# Altium schematic sheet 0181_BLANK.SchDoc
size 848 x 558 mm
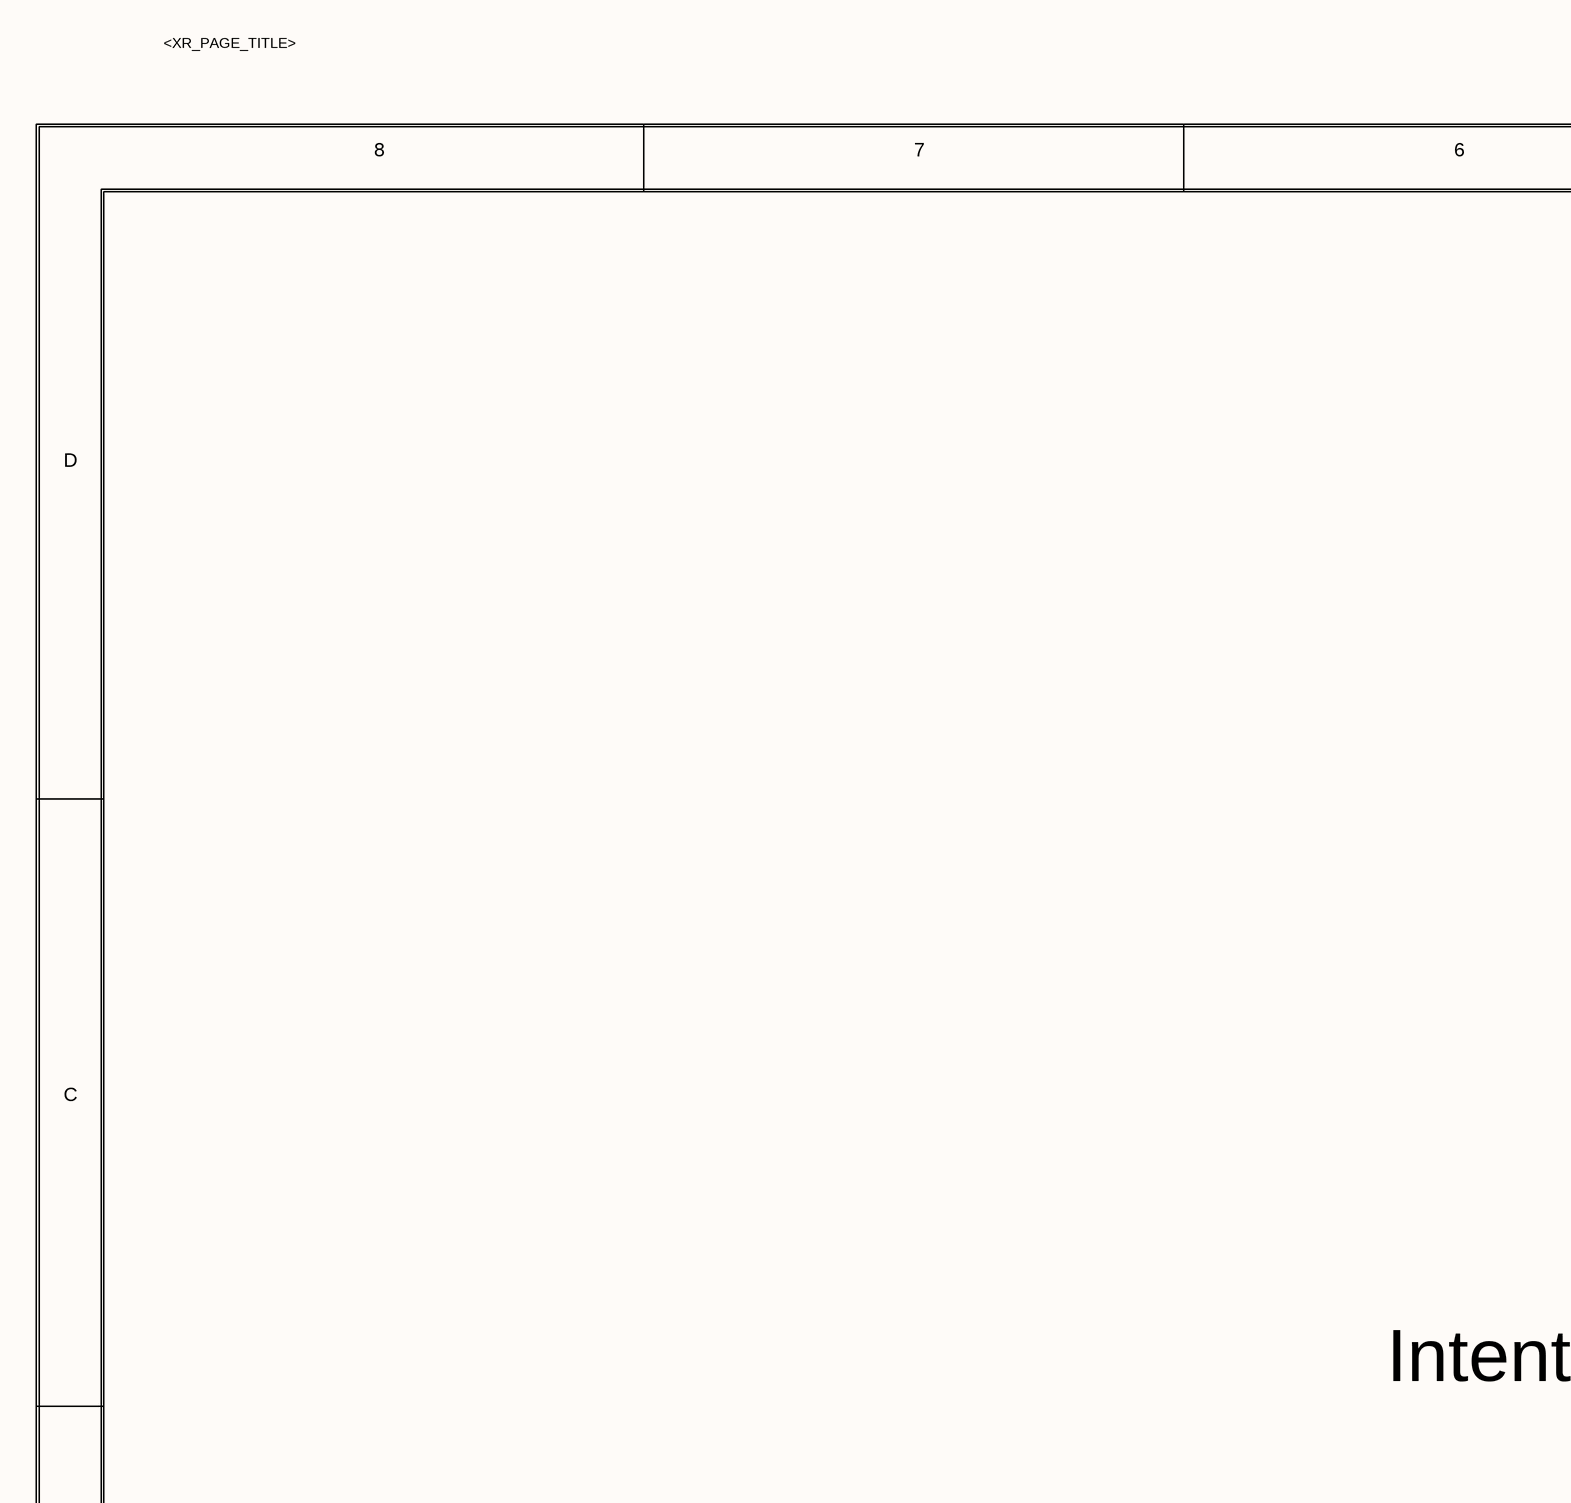
[diagram p0: 0181_BLANK.SchDoc, top left]
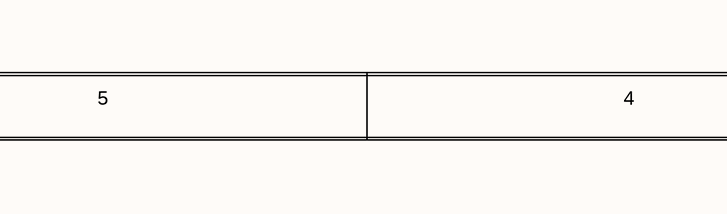
[diagram p1: 0181_BLANK.SchDoc, top middle]
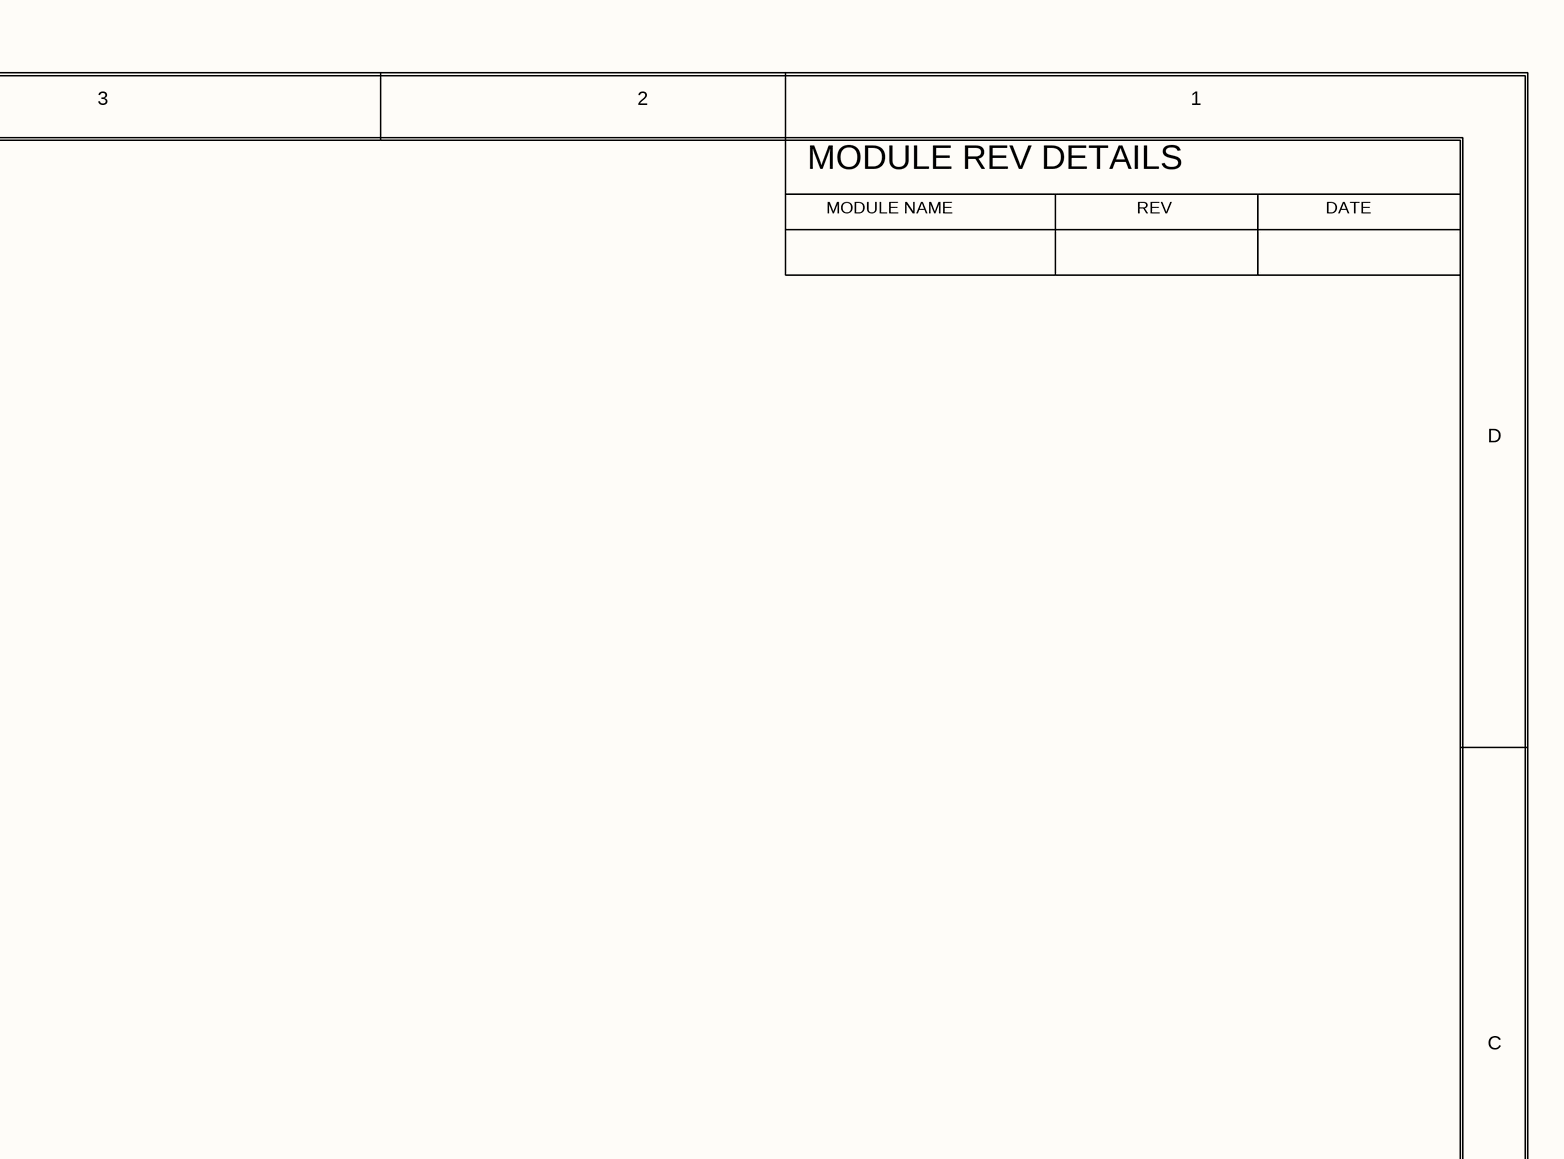
[diagram p2: 0181_BLANK.SchDoc, top right]
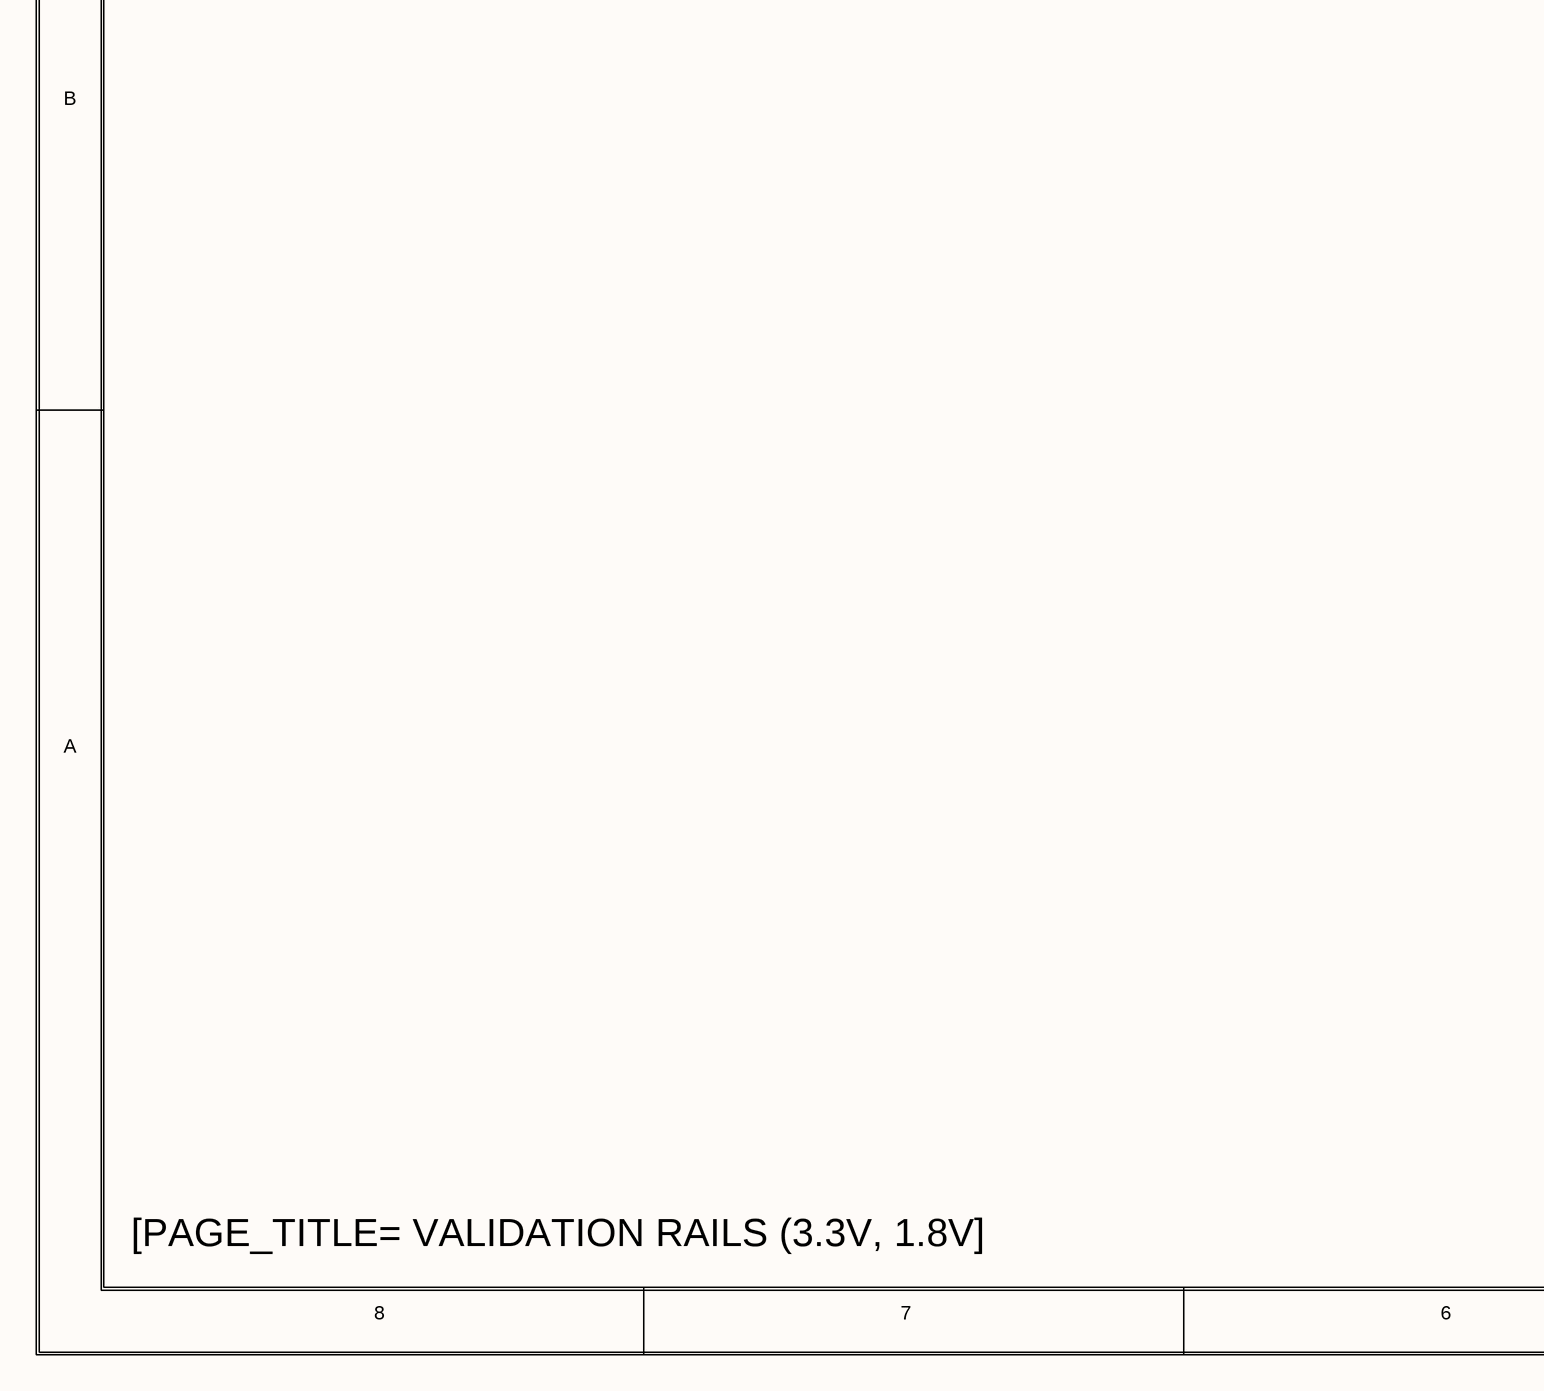
[diagram p3: 0181_BLANK.SchDoc, bottom left]
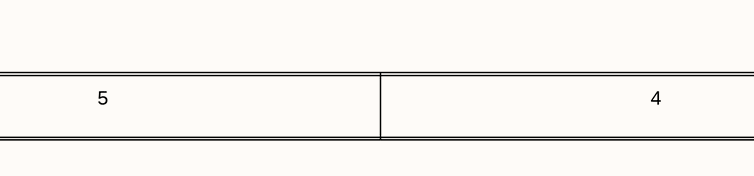
[diagram p4: 0181_BLANK.SchDoc, bottom middle]
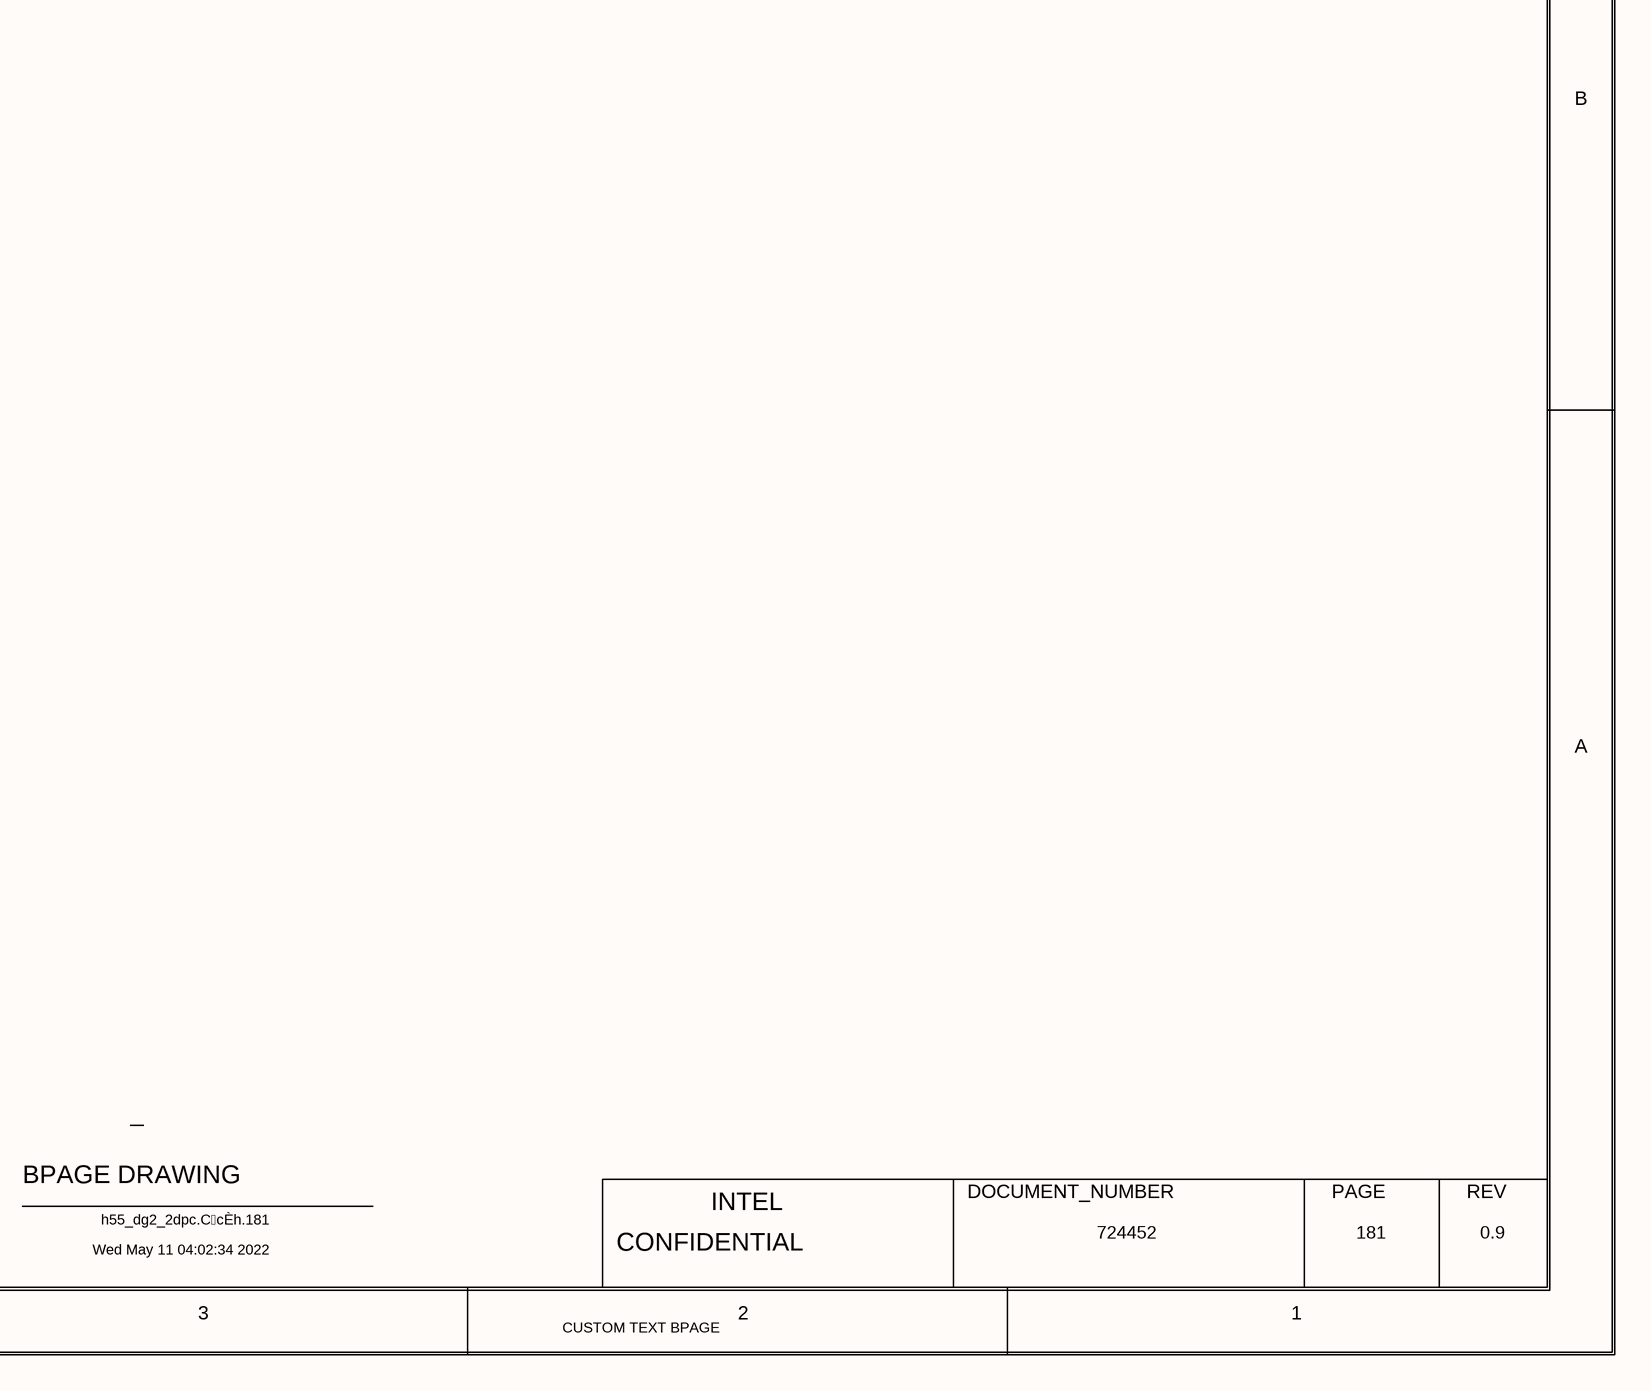
[diagram p5: 0181_BLANK.SchDoc, bottom right]

## Notes on the sheet
- <XR_PAGE_TITLE>
- 8
- 7
- 6
- 5
- 4
- 3
- 2
- 1
- MODULE REV DETAILS
- MODULE NAME
- REV
- DATE
- D
- C
- Intentionally Left Blank
- B
- A
- BPAGE DRAWING
- INTEL
- DOCUMENT_NUMBER
- PAGE
- [PAGE_TITLE= VALIDATION RAILS (3.3V, 1.8V]
- Wed May 11 04:02:34 2022
- h55_dg2_2dpc.CcÈh.181
- CONFIDENTIAL
- 724452
- 181
- 0.9
- CUSTOM TEXT BPAGE